# Altium schematic sheet 03-CPU Core.SchDoc
size A2; SheetNumber: 3; SheetTotal: 5; SPICEModelCacheQEJGZIRO: <root> / <DocumentId>QEJGZIRO</DocumentId> / <CacheFrame Number="0"> / <Model Name="diode" Kind="MDL"> / <Text>*Default Diode / *Diode Pinout: A,K / .MODEL DIODE D()</Text> / </Model> / <Model Name="xtal" Kind="CKT"> / <Text>*Generic type:crystal pkg:HC33/51 / .SUBCKT XTAL 1 2 PARAMS: FREQ=1Meg RS=750 C=13pf Q=1000 / LX 1 3 {((Q*RS)/(6.2831852*FREQ))} IC=0.5M / CX 3 4 {(1/(Q*6.2831852*FREQ*RS))} / C0 1 2 {C} / RS 4 2 {RS} / .ENDS XTAL</Text> / </Model> / <Model Name="led0" Kind="MDL"> / <Text>*Typ INFRARED GaAs LED: Vf=1.2V Vr=5V If=40mA trr=3uS / *LED Pinout: 1=A, 2=K / .MODEL LED0 D (IS=93.5P RS=84M N=2.63 BV=5 IBV=10U / + CJO=2.97P VJ=.75 M=.333 TT=4.32U)</Text> / </Model> / </CacheFrame> / </root>
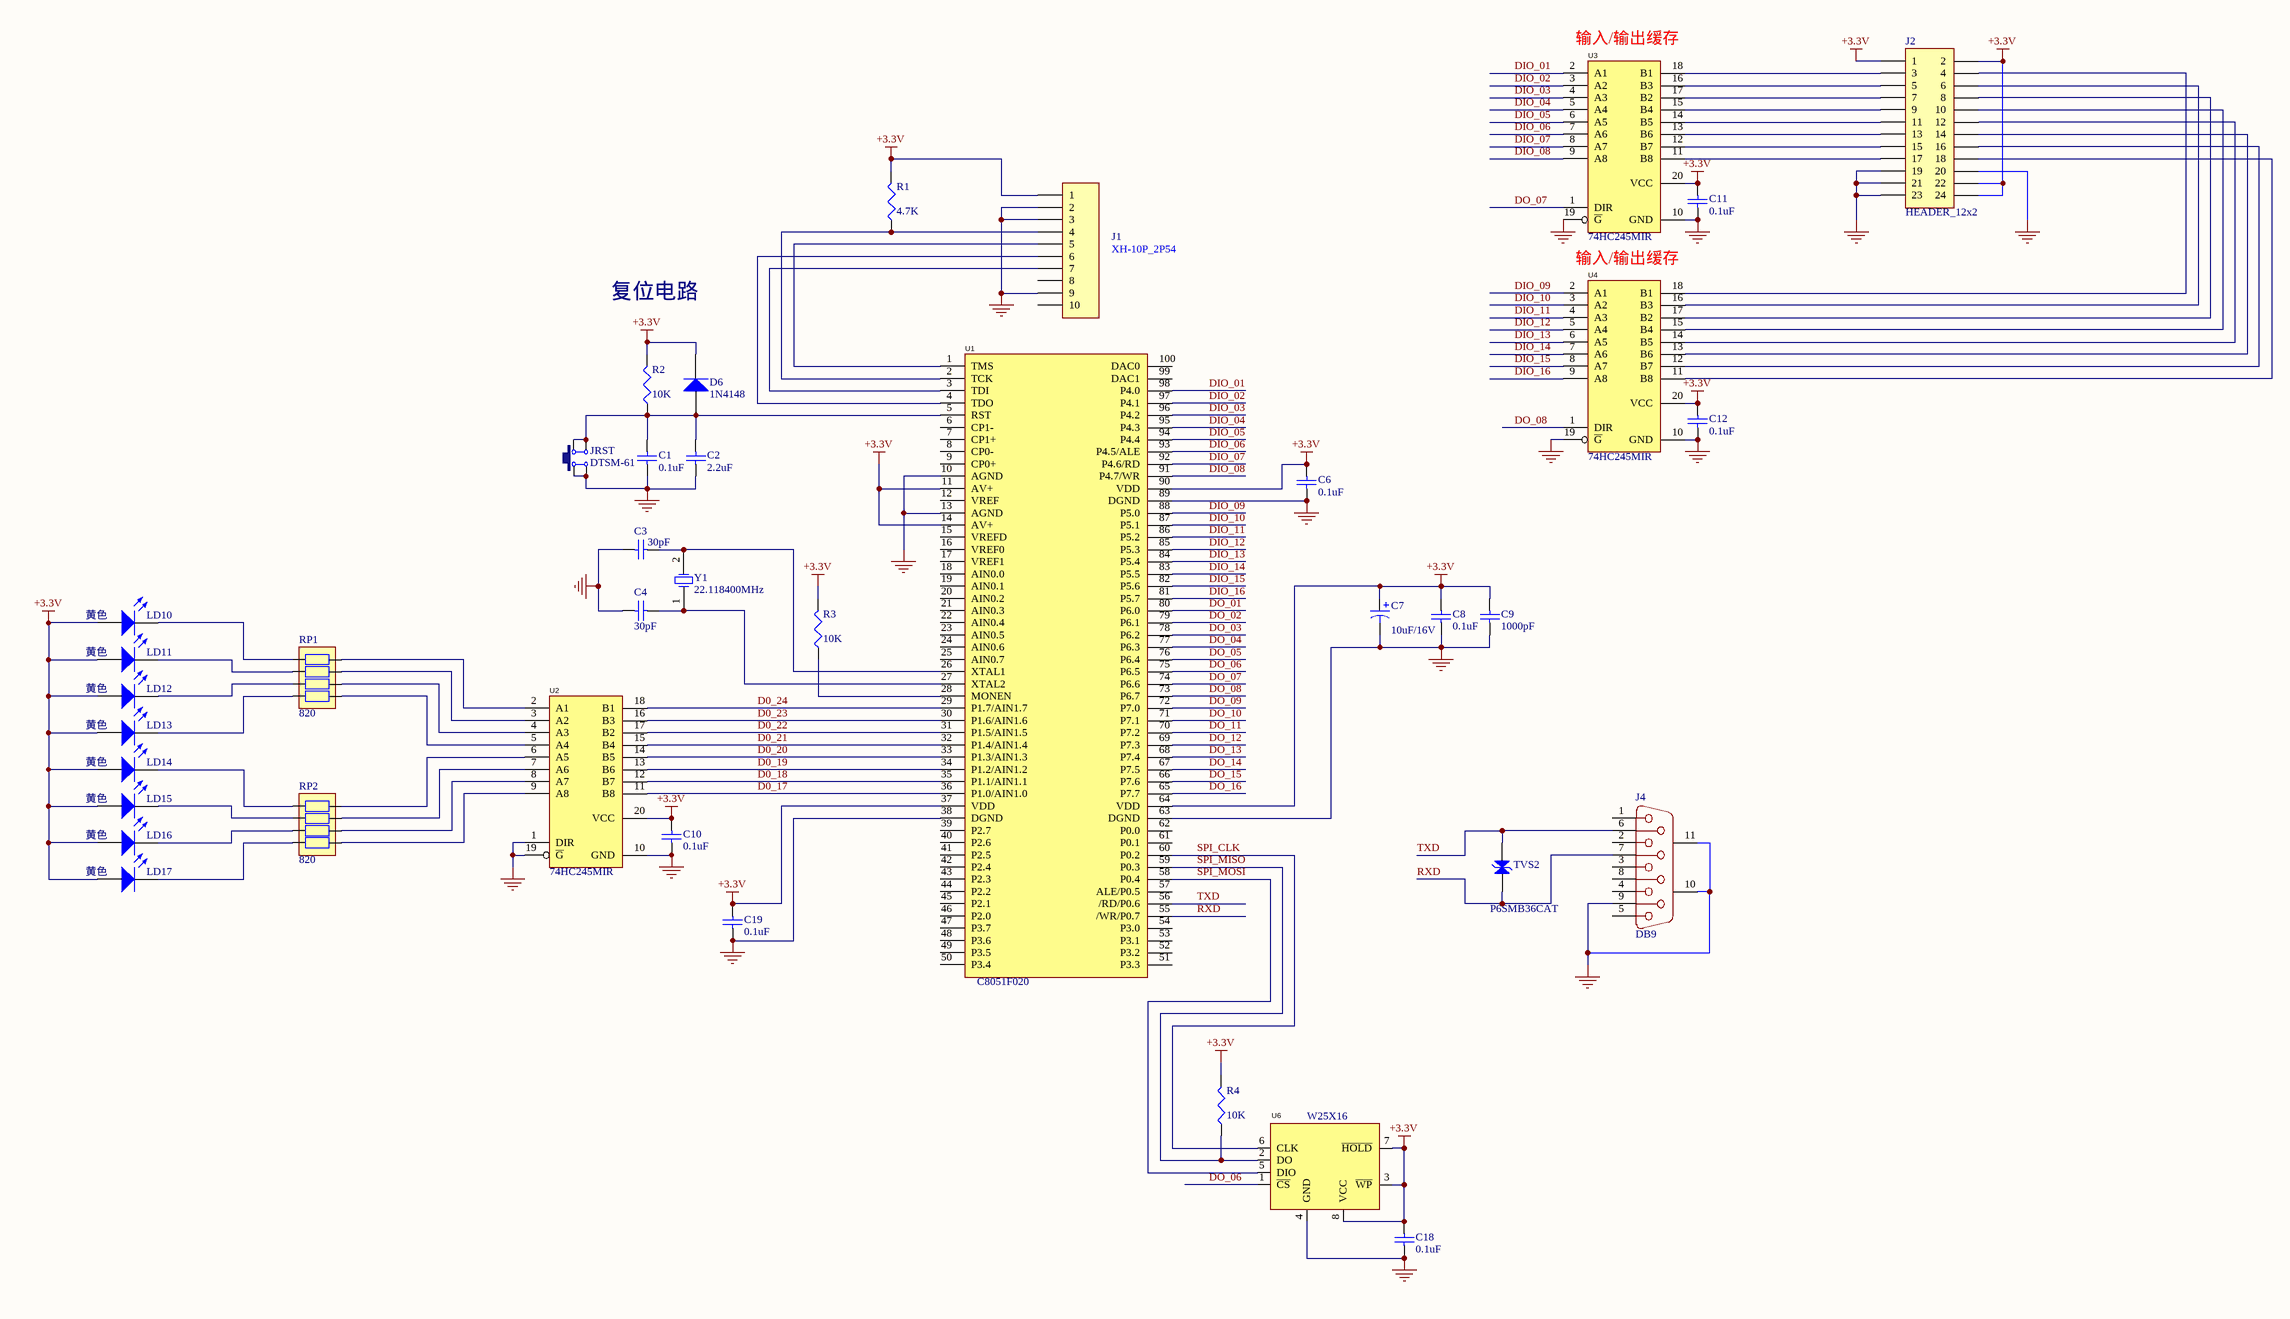
[diagram p0: 03-CPU Core.SchDoc]

## Parts
C1  value 0.1uF  [C0805]  (hidden comment: Cap)
C2  value 2.2uF  [C0805]  (hidden comment: Cap)
C3  value 30pF  [C0805]  (hidden comment: Cap)
C4  value 30pF  [C0805]  (hidden comment: Cap)
C6  value 0.1uF  [C0805]  (hidden comment: Cap)
C7  value 10uF/16V  [C3216]  (hidden comment: Cap Pol1)
C8  value 0.1uF  [C0805]  (hidden comment: Cap)
C9  value 1000pF  [C0805]  (hidden comment: Cap)
C10  value 0.1uF  [C0805]  (hidden comment: Cap)
C11  value 0.1uF  [C0805]  (hidden comment: Cap)
C12  value 0.1uF  [C0805]  (hidden comment: Cap)
C18  value 0.1uF  [C0805]  (hidden comment: Cap)
C19  value 0.1uF  [C0805]  (hidden comment: Cap)
D6  1N4148  [FR107W]
J1  XH-10P_2P54  [XH-10P_2P54]  (value not drawn)
J2  HEADER_12x2  [HEADER_12x2]
J4  DB9  [DB9]
JRST  DTSM-61  [DISM-61]
LD10  黄色  [LED0805]
LD11  黄色  [LED0805]
LD12  黄色  [LED0805]
LD13  黄色  [LED0805]
LD14  黄色  [LED0805]
LD15  黄色  [LED0805]
LD16  黄色  [LED0805]
LD17  黄色  [LED0805]
R1  value 4.7K  [R0805]  (hidden comment: Res3)
R2  value 10K  [R0805]  (hidden comment: Res3)
R3  value 10K  [R0805]  (hidden comment: Res3)
R4  value 10K  [R0805]  (hidden comment: Res3)
RP1  820  [RP]
RP2  820  [RP]
TVS2  P6SMB36CAT  [SMD]
U1  C8051F020  [TQFP-100]
U2  74HC245MIR  [SSOP-20]
U3  74HC245MIR  [SSOP-20]
U4  74HC245MIR  [SSOP-20]
U6  W25X16  [SOIC-8]
Y1  22.118400MHz  [HC-49]

## Nets
+3.3V: C6.2 C7.1 C8.2 C9.2 C10.2 C11.2 C12.2 C18.2 C19.2 D6.2(K) J1.1 J2.1 J2.2 J2.22 J2.24 LD10.1(A) LD11.1(A) LD12.1(A) LD13.1(A) LD14.1(A) LD15.1(A) LD16.1(A) LD17.1(A) R1.2 R2.2 R3.2 R4.2 U1.11(AV+) U1.14(AV+) U1.37(VDD) U1.64(VDD) U1.90(VDD) U2.20(VCC) U3.20(VCC) U4.20(VCC) U6.3(~{WP}) U6.7(~{HOLD}) U6.8(VCC)
GND: C1.2 C2.2 C3.1 C4.1 C6.1 C7.2 C8.1 C9.1 C10.1 C11.1 C12.1 C18.1 C19.1 J1.2 J1.3 J1.9 J2.19 J2.20 J2.21 J2.23 J4.9 J4.10(MH1) J4.11(MH2) JRST.1 JRST.4 U1.10(AGND) U1.13(AGND) U1.38(DGND) U1.63(DGND) U1.89(DGND) U2.1(DIR) U2.10(GND) U2.19(~{G}) U3.10(GND) U3.19(~{G}) U4.10(GND) U4.19(~{G}) U6.4(GND)
D0_17: U1.36(P1.0/AIN1.0) U2.11(B8)
D0_18: U1.35(P1.1/AIN1.1) U2.12(B7)
D0_19: U1.34(P1.2/AIN1.2) U2.13(B6)
D0_20: U1.33(P1.3/AIN1.3) U2.14(B5)
D0_21: U1.32(P1.4/AIN1.4) U2.15(B4)
D0_22: U1.31(P1.5/AIN1.5) U2.17(B2)
D0_23: U1.30(P1.6/AIN1.6) U2.16(B3)
D0_24: U1.29(P1.7/AIN1.7) U2.18(B1)
DIO_01: U1.98(P4.0) U3.2(A1)
DIO_02: U1.97(P4.1) U3.3(A2)
DIO_03: U1.96(P4.2) U3.4(A3)
DIO_04: U1.95(P4.3) U3.5(A4)
DIO_05: U1.94(P4.4) U3.6(A5)
DIO_06: U1.93(P4.5/ALE) U3.7(A6)
DIO_07: U1.92(P4.6/RD) U3.8(A7)
DIO_08: U1.91(P4.7/WR) U3.9(A8)
DIO_09: U1.88(P5.0) U4.2(A1)
DIO_10: U1.87(P5.1) U4.3(A2)
DIO_11: U1.86(P5.2) U4.4(A3)
DIO_12: U1.85(P5.3) U4.5(A4)
DIO_13: U1.84(P5.4) U4.6(A5)
DIO_14: U1.83(P5.5) U4.7(A6)
DIO_15: U1.82(P5.6) U4.8(A7)
DIO_16: U1.81(P5.7) U4.9(A8)
DO_01: U1.80(P6.0)
DO_02: U1.79(P6.1)
DO_03: U1.78(P6.2)
DO_04: U1.77(P6.3)
DO_05: U1.76(P6.4)
DO_06: U1.75(P6.5) U6.1(~{CS})
DO_07: U1.74(P6.6) U3.1(DIR)
DO_08: U1.73(P6.7) U4.1(DIR)
DO_09: U1.72(P7.0)
DO_10: U1.71(P7.1)
DO_11: U1.70(P7.2)
DO_12: U1.69(P7.3)
DO_13: U1.68(P7.4)
DO_14: U1.67(P7.5)
DO_15: U1.66(P7.6)
DO_16: U1.65(P7.7)
RXD: J4.7 TVS2.2(K) U1.55(/WR/P0.7)
SPI_CLK: U1.60(P0.2) U6.6(CLK)
SPI_MISO: R4.1 U1.59(P0.3) U6.2(DO)
SPI_MOSI: U1.58(P0.4) U6.5(DIO)
TXD: J4.6 TVS2.1(A) U1.56(/RD/P0.6)
NetC1_1: C1.1 C2.1 D6.1(A) JRST.2 JRST.3 R2.1 U1.5(RST)
NetC3_2: C3.2 U1.26(XTAL1) Y1.2(OSC2)
NetC4_2: C4.2 U1.27(XTAL2) Y1.1(OSC1)
NetJ1_4: J1.4 R1.1 U1.2(TCK)
NetJ1_5: J1.5 U1.1(TMS)
NetJ1_6: J1.6 U1.4(TDO)
NetJ1_7: J1.7 U1.3(TDI)
NetJ2_3: J2.3 U3.18(B1)
NetJ2_4: J2.4 U4.18(B1)
NetJ2_5: J2.5 U3.16(B3)
NetJ2_6: J2.6 U4.16(B3)
NetJ2_7: J2.7 U3.17(B2)
NetJ2_8: J2.8 U4.17(B2)
NetJ2_9: J2.9 U3.15(B4)
NetJ2_10: J2.10 U4.15(B4)
NetJ2_11: J2.11 U3.14(B5)
NetJ2_12: J2.12 U4.14(B5)
NetJ2_13: J2.13 U3.13(B6)
NetJ2_14: J2.14 U4.13(B6)
NetJ2_15: J2.15 U3.12(B7)
NetJ2_16: J2.16 U4.12(B7)
NetJ2_17: J2.17 U3.11(B8)
NetJ2_18: J2.18 U4.11(B8)
NetLD10_2: LD10.2(K) RP1.1
NetLD11_2: LD11.2(K) RP1.2
NetLD12_2: LD12.2(K) RP1.3
NetLD13_2: LD13.2(K) RP1.4
NetLD14_2: LD14.2(K) RP2.1
NetLD15_2: LD15.2(K) RP2.2
NetLD16_2: LD16.2(K) RP2.3
NetLD17_2: LD17.2(K) RP2.4
NetR3_1: R3.1 U1.28(MONEN)
NetRP1_5: RP1.5 U2.5(A4)
NetRP1_6: RP1.6 U2.4(A3)
NetRP1_7: RP1.7 U2.3(A2)
NetRP1_8: RP1.8 U2.2(A1)
NetRP2_5: RP2.5 U2.9(A8)
NetRP2_6: RP2.6 U2.8(A7)
NetRP2_7: RP2.7 U2.7(A6)
NetRP2_8: RP2.8 U2.6(A5)

Not connected (* = marked no-connect by the designer): J1 8 10; J4 1 2 3 4 5 8; U1 6(CP1-) 7(CP1+) 8(CP0-) 9(CP0+) 12(VREF) 15(VREFD) 16(VREF0) 17(VREF1) 18(AIN0.0) 19(AIN0.1) 20(AIN0.2) 21(AIN0.3) 22(AIN0.4) 23(AIN0.5) 24(AIN0.6) 25(AIN0.7) 39(P2.7) 40(P2.6) 41(P2.5) 42(P2.4) 43(P2.3) 44(P2.2) 45(P2.1) 46(P2.0) 47(P3.7) 48(P3.6) 49(P3.5) 50(P3.4) 51(P3.3) 52(P3.2) 53(P3.1) 54(P3.0) 57(ALE/P0.5) 61(P0.1) 62(P0.0) 99(DAC1) 100(DAC0)

## Notes on the sheet
- (near U3) 输入/输出缓存
- XH-10P_2P54
- 复位电路
- 输入/输出缓存

## Library data of the parts
C1-C4 C6 C8-C12 C18 C19 = Cap: Capacitor; Published: 8-Jun-2000; LatestRevisionDate: 17-Jul-2002; LatestRevisionNote: Re-released for DXP Platform.; PackageReference: RAD-0.3; Publisher: Altium Limited; PackageDescription: Radial Cap, Thru-Hole; 2 Leads; 0.3 in Pin Spacing
C7 = Cap Pol1: Polarized Capacitor (Radial); Published: 8-Jun-2000; LatestRevisionDate: 17-Jul-2002; LatestRevisionNote: Re-released for DXP Platform.; PackageReference: RB7.6-15; Publisher: Altium Limited; PackageDescription: Polarized Capacitor (Radial); 2 Leads
D6 = Diode: Default Diode; Published: 8-Jun-2000; LatestRevisionDate: 17-Jul-2002; LatestRevisionNote: Re-released for DXP Platform.; PackageVersion: Sep-1996; PackageReference: SMC; Publisher: Altium Limited; PackageDescription: DO-214-AB/SMC; 2 C-Bend Leads; Body 7.9 x 5.9 mm, inc. leads (LxW); Code_JEDEC: DO-214-AB
J1 = Header 10: Header, 10-Pin; LatestRevisionDate: 17-Jul-2002; LatestRevisionNote: Re-released for DXP Platform.; Publisher: Altium Limited
J2 = Header 12X2: Header, 12-Pin, Dual row; LatestRevisionDate: 17-Jul-2002; LatestRevisionNote: Re-released for DXP Platform.; Publisher: Altium Limited
LD10-LD17 = LED0: Typical INFRARED GaAs LED; Published: 8-Jun-2000; LatestRevisionDate: 08-Jul-2005; LatestRevisionNote: Mech Layer 1 removed.; PackageReference: LED-0; Publisher: Altium Limited; PackageDescription: LED; 2 Leads
R1-R4 = Res3: Resistor; Published: 8-Jun-2000; LatestRevisionDate: 29-May-2009; LatestRevisionNote: IPC-7351 Footprint Added.; PackageReference: J1-0603; Publisher: Altium Limited; PackageDescription: Chip Resistor
RP1 RP2 = RP 820
TVS2 = SMD
U1 = C8051F020: Manufacturer: SKYWORKS/SILICON LABS(芯科); Symbol: C8051F020-GQR; Add into BOM: yes; CPU Core: 51系列; Program Storage Size: 64KB; GPIO Ports Number: 64; Operating Voltage Range: 2.7V~3.6V; CPU Maximum Speed: 25MHz; ADC (Bit): 12bit；8bit; DAC (Bit): 12bit; Peripheral/Function: 温度传感器; Watchdog: 有; Device: C8051F020-GQR; LCSC Part Name: C8051F020-GQR; Supplier Part: C18087; Manufacturer Part: C8051F020-GQR; Supplier Footprint: TQFP-100(14x14); JLCPCB Part Class: Extended Part; Datasheet: https://atta.szlcsc.com/upload/public/pdf/source/20160318/1458266986324.pdf; Supplier: LCSC; Convert to PCB: yes; Operating Temperature Range: -40℃~+85℃; Universal Serial Bus: -; Low-Voltage Detect: 有; Secure Digital Input and Output: -; Internal Oscillator: 有
U2-U4 = 74HC245MIR: Manufacturer: Nexperia(安世); Symbol: 74HC245PW,118; Add into BOM: yes; output type: 三态; Supply Voltage: 2V~6V; Number of Elements: 1; Number of Bits per Element: 8; Sink Current: 7.8mA; Logic Family: 74HC; Device: 74HC245PW,118; LCSC Part Name: 74HC245PW,118; Supplier Part: C5626; Manufacturer Part: 74HC245PW,118; Supplier Footprint: TSSOP-20; JLCPCB Part Class: Extended Part; Datasheet: https://atta.szlcsc.com/upload/public/pdf/source/20180326/C70245_56281BCF84F9E7641D2BBB6A629E618A.pdf; Supplier: LCSC; Convert to PCB: yes; Input type: -; Channel Type: -; Source Current: 7.8mA; Operating Temperature: -40℃~+125℃
U6 = W25X16: Manufacturer: WINBOND(华邦); Symbol: W25X16VSSIG; Add into BOM: yes; Device: W25X16VSSIG; Supplier: LCSC; Supplier Part: C13586; Manufacturer Part: W25X16VSSIG; JLCPCB Part Class: Extended Part; LCSC Part Name: W25X16VSSIG 停产; Supplier Footprint: SOIC-8-208mil; Datasheet: https://atta.szlcsc.com/upload/public/pdf/source/20130607/1457706608717.pdf; Convert to PCB: yes
Y1 = XTAL: Crystal Oscillator; Published: 8-Jun-2000; LatestRevisionDate: 17-Jul-2002; LatestRevisionNote: Re-released for DXP Platform.; PackageReference: R38; Publisher: Altium Limited; PackageDescription: Crystal, Thru-Hole; 2 Leads; Body 3.1 x 8.2 mm (Dia.xH)